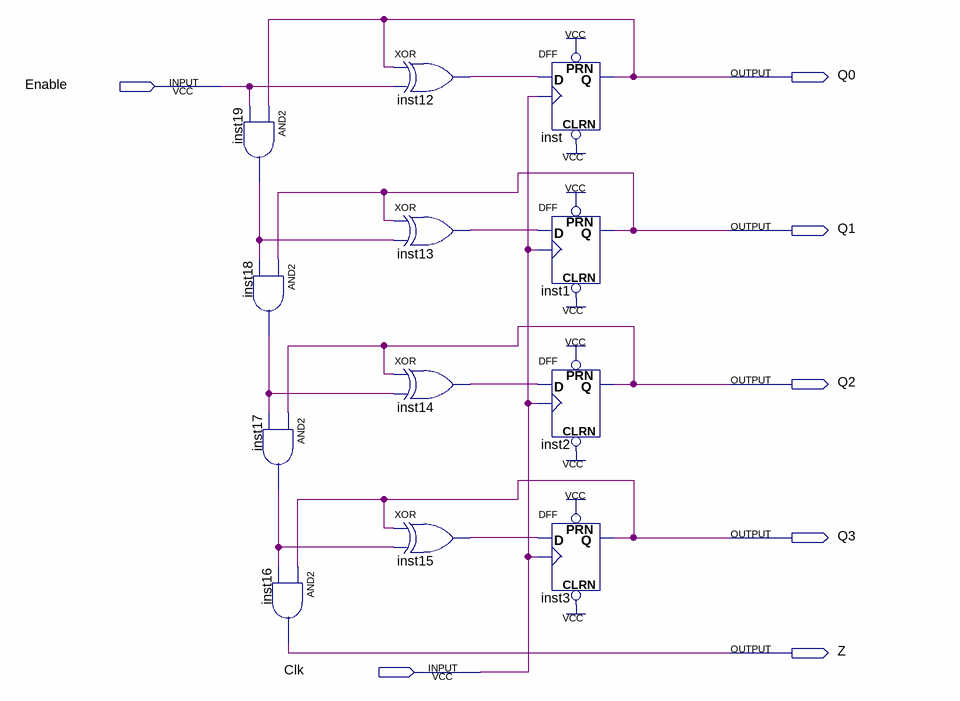
[diagram p0: schematic sheet]
// Quartus schematic lab10step2a.bdf as structural Verilog: 12 symbols, 7 pins
module lab10step2a (
  input  Enable,
  input  Clk,
  output Q0,
  output Q1,
  output Q2,
  output Q3,
  output Z
);

  wire inst12_out, inst13_out, inst14_out, inst15_out, inst17_out, inst18_out, inst19_out;

  and inst19 (inst19_out, Q0, Enable);
  and inst18 (inst18_out, Q1, inst19_out);
  and inst17 (inst17_out, Q2, inst18_out);
  and inst16 (Z, Q3, inst17_out);
  xor inst12 (inst12_out, Q0, Enable);
  xor inst13 (inst13_out, Q1, inst19_out);
  xor inst14 (inst14_out, Q2, inst18_out);
  xor inst15 (inst15_out, Q3, inst17_out);
  DFF inst (.CLRN(1'b1), .CLK(Clk), .D(inst12_out), .PRN(1'b1), .Q(Q0));
  DFF inst1 (.CLRN(1'b1), .CLK(Clk), .D(inst13_out), .PRN(1'b1), .Q(Q1));
  DFF inst2 (.CLRN(1'b1), .CLK(Clk), .D(inst14_out), .PRN(1'b1), .Q(Q2));
  DFF inst3 (.CLRN(1'b1), .CLK(Clk), .D(inst15_out), .PRN(1'b1), .Q(Q3));
endmodule
